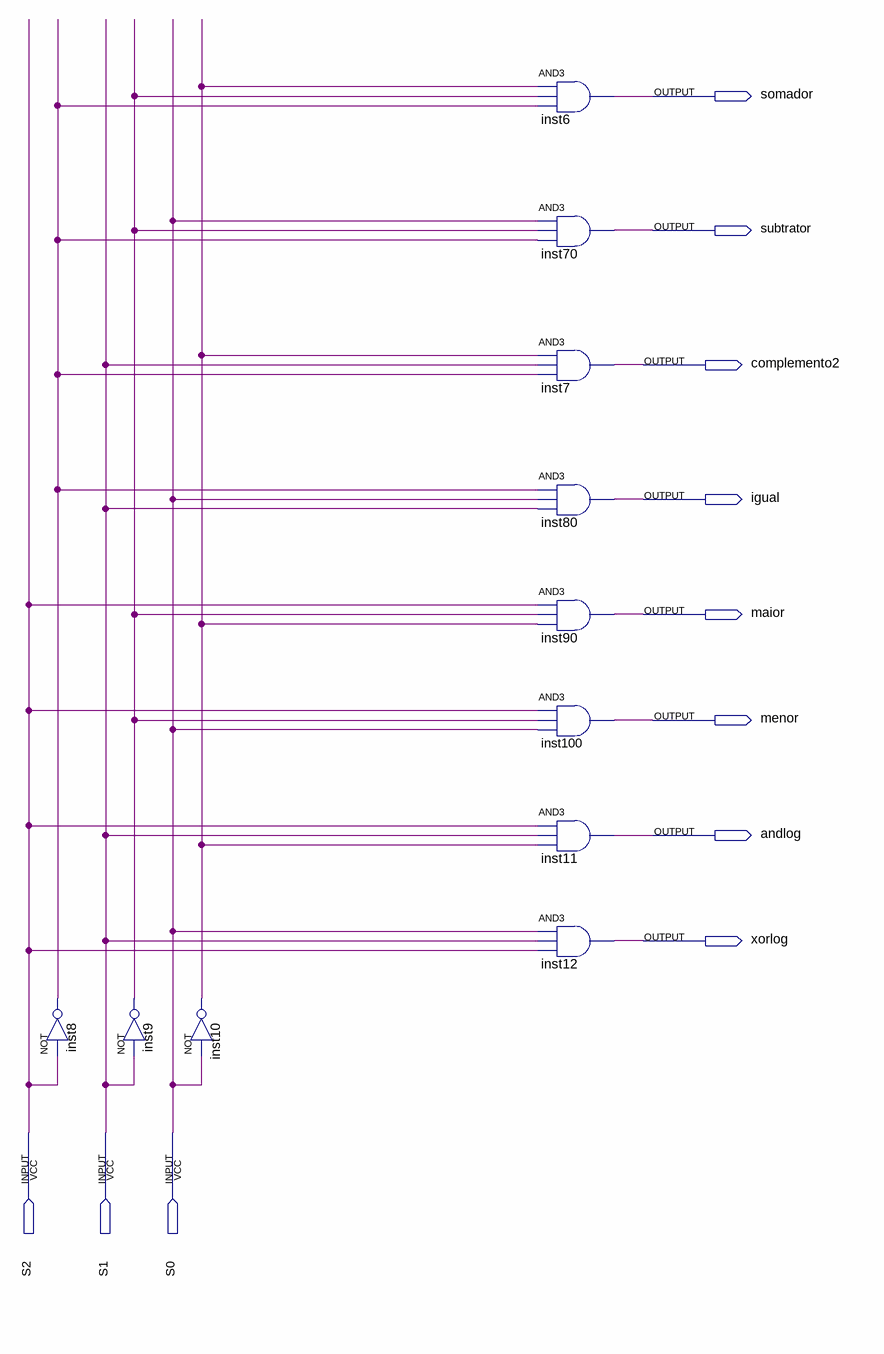
[diagram p0: schematic sheet]
// Quartus schematic demux.bdf as structural Verilog: 11 symbols, 11 pins
module demux (
  input  S2,
  input  S1,
  input  S0,
  output somador,
  output subtrator,
  output complemento2,
  output igual,
  output maior,
  output menor,
  output andlog,
  output xorlog
);

  wire inst8_out, inst9_out, inst10_out;

  not inst8 (inst8_out, S2);
  not inst9 (inst9_out, S1);
  not inst10 (inst10_out, S0);
  and inst6 (somador, inst10_out, inst9_out, inst8_out);
  and inst70 (subtrator, S0, inst9_out, inst8_out);
  and inst7 (complemento2, inst10_out, S1, inst8_out);
  and inst80 (igual, inst8_out, S0, S1);
  and inst90 (maior, S2, inst9_out, inst10_out);
  and inst100 (menor, S2, inst9_out, S0);
  and inst11 (andlog, S2, S1, inst10_out);
  and inst12 (xorlog, S0, S1, S2);
endmodule
